# EAGLE design omnetics_nano_breakout_v1 (EAGLE 8.2.2)
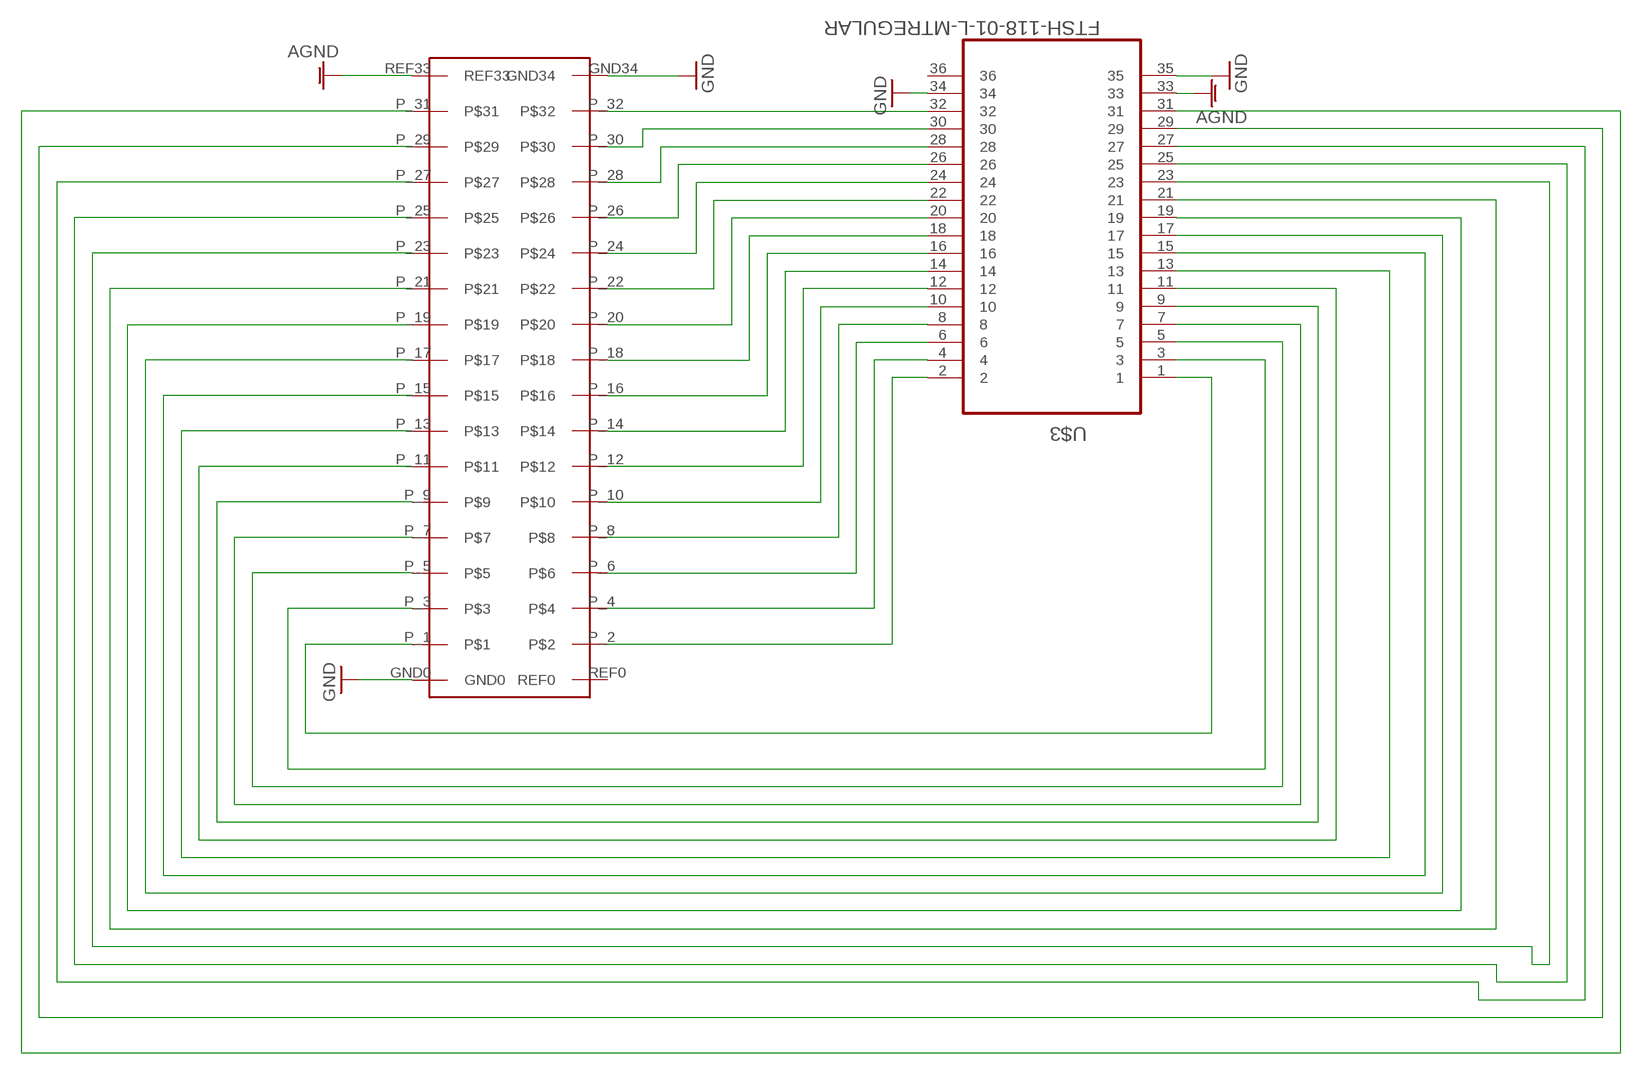
[diagram p0: schematic, sheet 1]

## Parts
U$2  OMNETICS_NANO_18X2  [OMNETICS_NANO_18X2]
U$3  FTSH-118-01-L-MTREGULAR  [FTSH-118-01-L-MT]

## Nets
AGND: U$2.REF33 U$3.33
GND: U$2.GND0 U$2.GND34 U$3.34 U$3.35
N$1: U$2.P_1 U$3.1
N$2: U$2.P_2 U$3.2
N$3: U$2.P_4 U$3.4
N$4: U$2.P_6 U$3.6
N$5: U$2.P_8 U$3.8
N$6: U$2.P_10 U$3.10
N$7: U$2.P_12 U$3.12
N$8: U$2.P_14 U$3.14
N$9: U$2.P_16 U$3.16
N$10: U$2.P_18 U$3.18
N$11: U$2.P_20 U$3.20
N$12: U$2.P_22 U$3.22
N$13: U$2.P_24 U$3.24
N$14: U$2.P_26 U$3.26
N$15: U$2.P_28 U$3.28
N$16: U$2.P_30 U$3.30
N$17: U$2.P_32 U$3.32
N$18: U$2.P_3 U$3.3
N$19: U$2.P_5 U$3.5
N$20: U$2.P_7 U$3.7
N$21: U$2.P_9 U$3.9
N$22: U$2.P_11 U$3.11
N$23: U$2.P_13 U$3.13
N$24: U$2.P_15 U$3.15
N$25: U$2.P_17 U$3.17
N$26: U$2.P_19 U$3.19
N$27: U$2.P_21 U$3.21
N$28: U$2.P_23 U$3.23
N$29: U$2.P_25 U$3.25
N$30: U$2.P_27 U$3.27
N$31: U$2.P_29 U$3.29
N$32: U$2.P_31 U$3.31
Unconnected: U$2.REF0 U$3.36

## Library data of the parts
U$2 = Sombeck_lib:OMNETICS_NANO_18X2
U$3 = tuckerLib:FTSH-118-01-L-MT

## Board
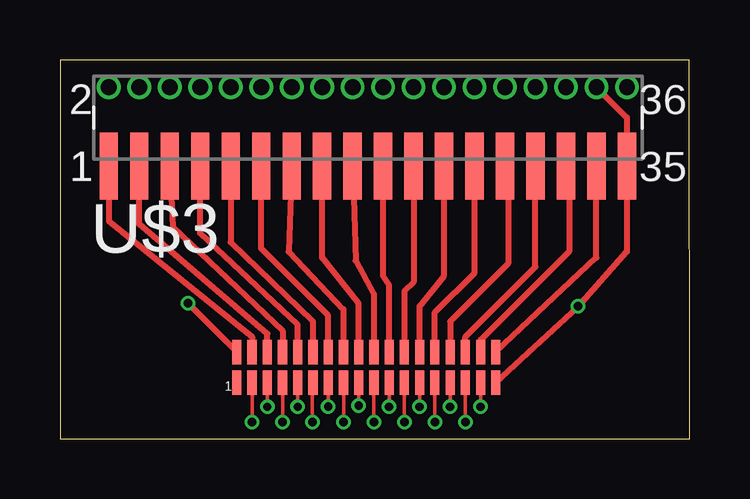
[diagram p1: board, top side]
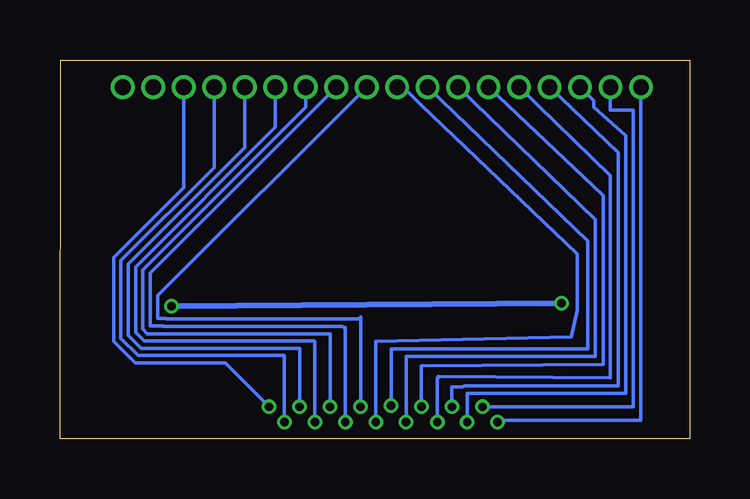
[diagram p2: board, bottom side, seen from below]

Size 26.24 x 15.8 mm. Coordinates in mm from the lower left corner, seen from the top.
Outline: 0,0 26.24,0 26.21,15.8 0,15.8 0,0
Copper layers (1*16): Top 0.035559375mm / dielectric 1.6mm / Bottom 0.035559375mm
Design rules "oshpark-2layer": minimum track width 6mil, minimum drill 10mil, track to track 6mil, track to pad 6mil, pad to pad 6mil, via to via 6mil, smd to smd 6mil, copper to edge 15mil, drill to drill 6mil, minimum pad ring 5mil, minimum via ring 5mil, stop-mask expansion 2.5mil, vias tented up to drill 0mil, thermal gap 10mil

### Footprints (pad centres in the part's own frame; a part is rotated, then mirrored left to right if it is on the bottom)
OMNETICS_NANO_18X2 = smd 0.381 x 1.016: GND0 0,1.27; GND34 10.795,0; P_1 0.635,1.27; P_2 0.635,0; P_3 1.27,1.27; P_4 1.27,0; P_5 1.905,1.27; P_6 1.905,0; P_7 2.54,1.27; P_8 2.54,0; P_9 3.175,1.27; P_10 3.175,0; P_11 3.81,1.27; P_12 3.81,0; P_13 4.445,1.27; P_14 4.445,0; P_15 5.08,1.27; P_16 5.08,0; P_17 5.715,1.27; P_18 5.715,0; P_19 6.35,1.27; P_20 6.35,0; P_21 6.985,1.27; P_22 6.985,0; P_23 7.62,1.27; P_24 7.62,0; P_25 8.255,1.27; P_26 8.255,0; P_27 8.89,1.27; P_28 8.89,0; P_29 9.525,1.27; P_30 9.525,0; P_31 10.16,1.27; P_32 10.16,0; REF0 0,0; REF33 10.795,1.27
FTSH-118-01-L-MT = smd 0.762 x 2.794: 1 -9.525,-2.032; 3 -8.255,-2.032; 5 -6.985,-2.032; 7 -5.715,-2.032; 9 -4.445,-2.032; 11 -3.175,-2.032; 13 -1.905,-2.032; 15 -0.635,-2.032; 17 0.635,-2.032; 19 1.905,-2.032; 21 3.175,-2.032; 23 4.445,-2.032; 25 5.715,-2.032; 27 6.985,-2.032; 29 8.255,-2.032; 31 9.525,-2.032; 33 10.795,-2.032; 35 12.065,-2.032 | drill 0.66: 2 -9.525,1.27; 4 -8.255,1.27; 6 -6.985,1.27; 8 -5.715,1.27; 10 -4.445,1.27; 12 -3.175,1.27; 14 -1.905,1.27; 16 -0.635,1.27; 18 0.635,1.27; 20 1.905,1.27; 22 3.175,1.27; 24 4.445,1.27; 26 5.715,1.27; 28 6.985,1.27; 30 8.255,1.27; 32 9.525,1.27; 34 10.795,1.27; 36 12.065,1.27

### Placement (x,y rotation side)
U$2  7.37,2.35 0 top
U$3  11.56,13.4 0 top

### Tracks (layer width: path | path; a pad name or v marks a point on that pad's centre or on a via)
AGND
  Top 0.254: U$2.REF33 22.35,7.56 U$3.33
GND  (via drill 0.35)
  Top 0.254: U$2.GND34 v21.59,5.52 23.62,7.81 U$3.35 23.62,13.4 U$3.34 | U$2.GND0 v5.33,5.65
  Bottom 0.254: v5.33,5.65 v21.59,5.52
N$1
  Top 0.254: U$3.1 2.03,9.08 8,4.25 U$2.P_1
N$2  (via drill 0.35)
  Top 0.152: U$2.P_2 v8,0.7
  Bottom 0.152: v8,0.7 8,0.76 2.03,0.76 U$3.2
N$3  (via drill 0.35)
  Top 0.152: U$2.P_4 v8.64,1.33
  Bottom 0.152: U$3.4 3.3,13.72 2.35,13.72 2.35,1.33 v8.64,1.33
N$4  (via drill 0.35)
  Top 0.152: U$2.P_6 v9.27,0.7
  Bottom 0.152: v9.27,0.7 9.27,1.91 2.67,1.91 2.67,12.64 4,13.84 4,14.1 U$3.6
N$5  (via drill 0.35)
  Top 0.152: U$2.P_8 v9.91,1.33
  Bottom 0.152: v9.91,1.33 9.91,2.16 9.45,2.16 9.4,2.21 2.98,2.21 2.98,11.94 U$3.8
N$6  (via drill 0.35)
  Top 0.152: U$2.P_10 arc90 10.52,2.33 v10.52,0.7
  Bottom 0.152: v10.52,0.7 10.52,2.54 10.48,2.54 10.48,2.6 3.3,2.54 3.3,10.99 U$3.10
N$7  (via drill 0.35)
  Top 0.152: U$2.P_12 arc90 11.18,2.22 v11.18,1.35
  Bottom 0.152: v11.18,1.35 11.18,3.05 3.61,3.11 3.61,10.15 U$3.12
N$8  (via drill 0.35)
  Top 0.152: U$2.P_14 arc90 11.82,2.23 v11.82,0.7
  Bottom 0.152: v11.82,0.7 11.82,3.43 3.94,3.43 3.94,9.14 U$3.14
N$9  (via drill 0.35)
  Top 0.152: U$2.P_16 v12.45,1.38
  Bottom 0.152: v12.45,1.38 12.45,3.75 4.25,3.75 4.25,8.26 U$3.16
N$10  (via drill 0.35)
  Top 0.152: U$2.P_18 v13.08,0.7
  Bottom 0.152: v13.08,0.7 13.08,4.06 4.94,4.25 4.69,5.36 4.68,5.56 4.68,7.71 11.21,13.94 11.95,14.67 U$3.18
N$11  (via drill 0.35)
  Top 0.152: U$2.P_20 v13.72,1.33
  Bottom 0.152: v13.72,1.33 13.72,5.08 13.8,4.99 21.81,4.99 21.83,5.02 22.16,5.02 22.16,5.97 U$3.20
N$12  (via drill 0.35)
  Top 0.152: U$2.P_22 v14.35,0.7
  Bottom 0.152: v14.35,0.7 14.35,4.63 14.41,4.63 14.47,4.69 21.94,4.69 21.95,4.7 22.48,4.7 22.48,6.92 U$3.22
N$13  (via drill 0.35)
  Top 0.152: U$2.P_24 v14.99,1.33
  Bottom 0.152: v14.99,1.33 14.99,4.38 15.05,4.38 22.59,4.38 22.78,4.57 22.78,7.05 16,13.83 U$3.24
N$14  (via drill 0.35)
  Top 0.152: U$2.P_26 v15.62,0.7
  Bottom 0.152: v15.62,0.7 15.62,4.06 15.64,4.08 22.72,4.08 23.09,4.45 23.09,7.17 17.27,12.99 U$3.26
N$15  (via drill 0.35)
  Top 0.152: U$2.P_28 v16.26,1.33
  Bottom 0.152: v16.26,1.33 16.26,3.78 22.85,3.78 23.39,4.32 23.39,7.3 18.54,12.15 U$3.28
N$16  (via drill 0.35)
  Top 0.152: U$2.P_30 v16.89,0.7
  Bottom 0.152: v16.89,0.7 16.89,3.47 22.97,3.47 23.7,4.19 23.7,7.43 19.81,11.31 U$3.30
N$17  (via drill 0.35)
  Top 0.152: U$2.P_32 v17.53,1.33
  Bottom 0.152: v17.53,1.33 19.36,3.17 23.1,3.17 24,4.07 24,7.55 21.08,10.47 U$3.32
N$18
  Top 0.254: U$2.P_3 8.64,4.38 3.3,8.95 U$3.3
N$19
  Top 0.254: U$3.5 4.7,8.83 9.27,4.51 U$2.P_5
N$20
  Top 0.254: U$2.P_7 9.91,4.76 5.84,8.57 U$3.7
N$21
  Top 0.254: U$3.9 7.11,8.19 10.54,4.89 U$2.P_9
N$22
  Top 0.254: U$2.P_11 11.18,5.14 8.38,7.94 U$3.11
N$23
  Top 0.254: U$3.13 9.53,7.81 11.81,5.4 U$2.P_13
N$24
  Top 0.254: U$2.P_15 12.45,5.65 10.92,7.56 U$3.15
N$25
  Top 0.254: U$3.17 12.32,7.43 13.08,6.03 U$2.P_17
N$26
  Top 0.254: U$2.P_19 13.72,6.41 13.46,6.79 U$3.19
N$27
  Top 0.254: U$3.21 14.73,6.54 14.35,6.16 U$2.P_21
N$28
  Top 0.254: U$2.P_23 14.99,5.52 16,6.79 U$3.23
N$29
  Top 0.254: U$2.P_25 15.62,5.27 17.27,6.92 U$3.25
N$30
  Top 0.254: U$3.27 18.67,11.24 18.67,7.3 16.26,4.89 U$2.P_27
N$31
  Top 0.254: U$2.P_29 16.89,4.25 19.81,7.17 U$3.29
N$32
  Top 0.254: U$3.31 21.21,11.24 21.21,7.81 17.53,4.13 U$2.P_31